# EAGLE design iDB2_Bridge_PCB_Rev1 (EAGLE 9.6.1)
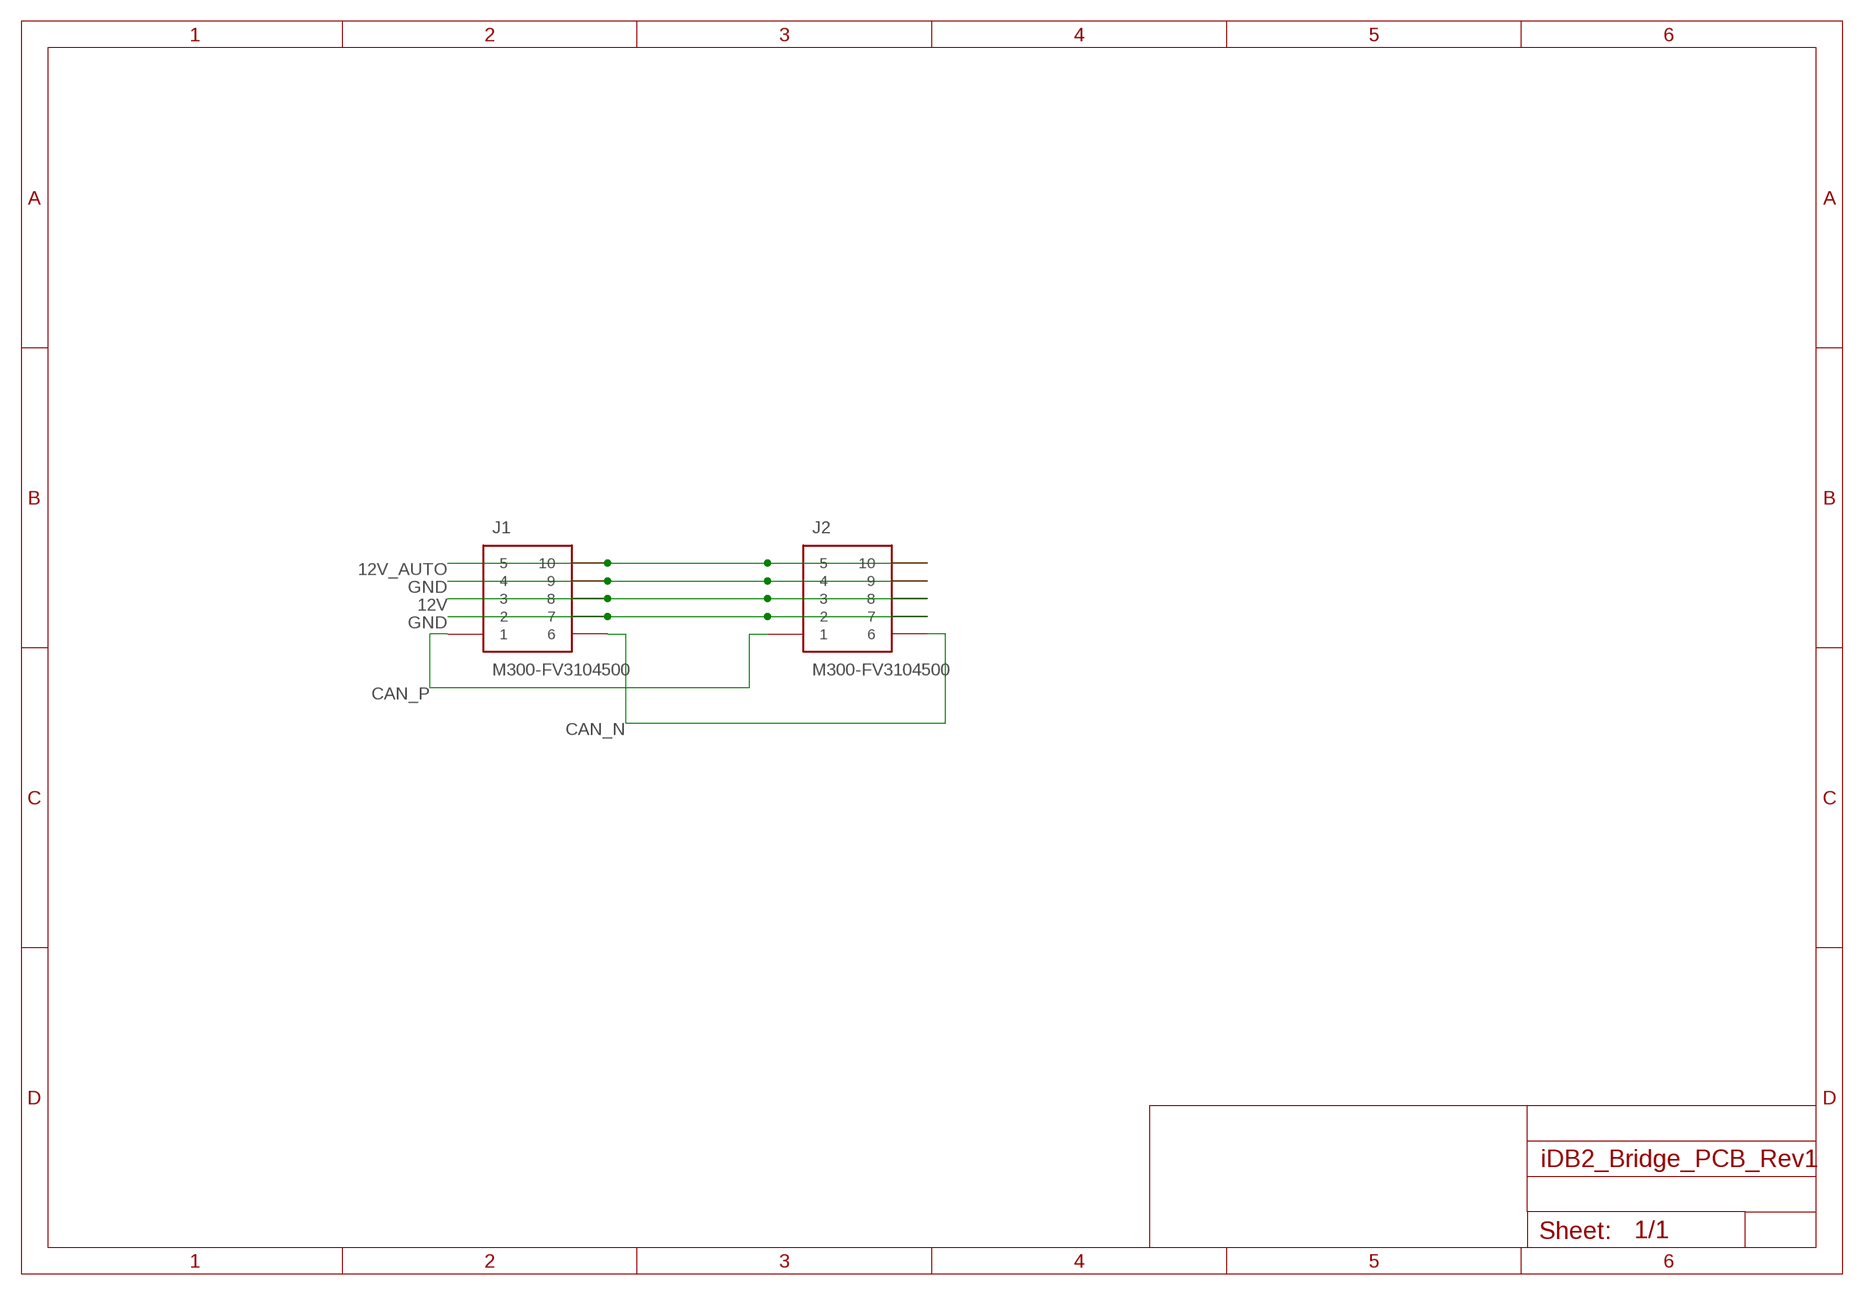
[diagram p0: schematic, sheet 1]

## Parts
J1  M300-FV3104500  [M300-FV3104500]
J2  M300-FV3104500  [M300-FV3104500]

## Nets
12V: J1.3 J1.8 J2.3 J2.8
12V_AUTO: J1.5 J1.10 J2.5 J2.10
CAN_N: J1.6 J2.6
CAN_P: J1.1 J2.1
GND: J1.2 J1.4 J1.7 J1.9 J2.2 J2.4 J2.7 J2.9

## Library data of the parts
J1 J2 = RescueRunner:M300-FV3104500: Headers & Wire Housings 10 WAY MALE PC TAIL DIL WJS Source: Datasheet <https://componentsearchengine.com/Datasheets/1/M300-MV31045M1.pdf>

## Net classes
0 default: width 0.2 mm

## Board
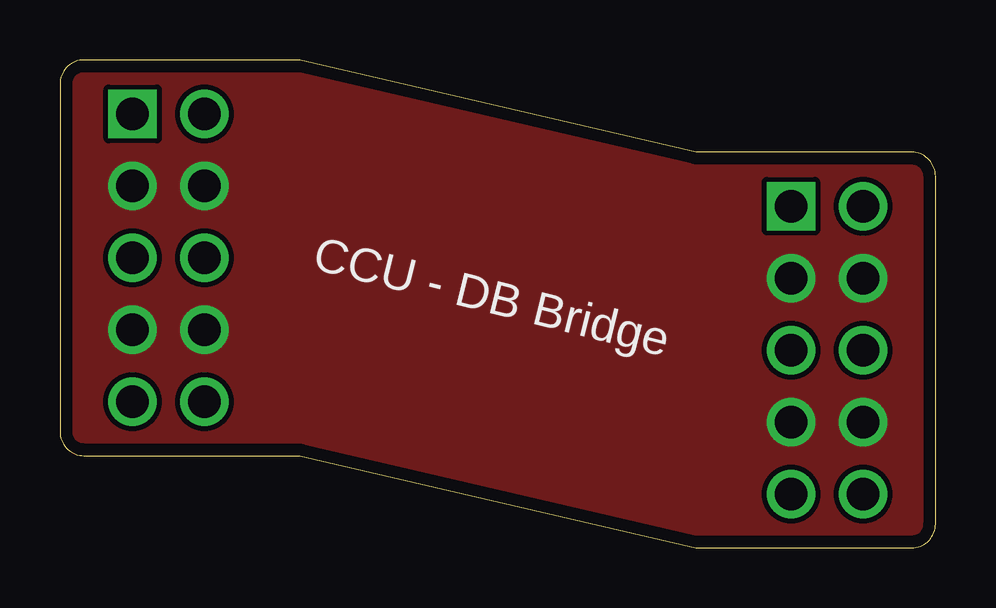
[diagram p1: board, top side]
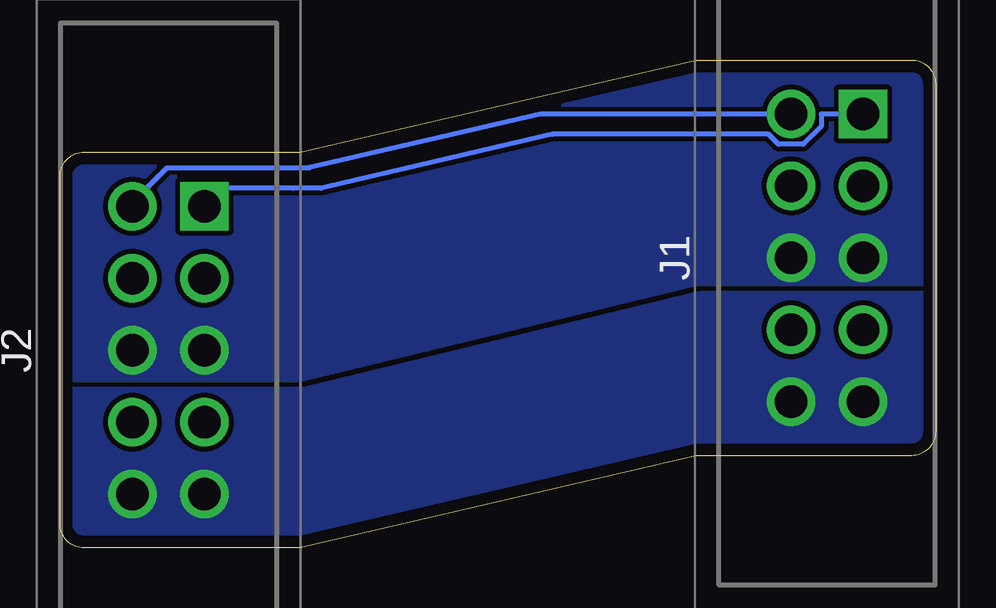
[diagram p2: board, bottom side, seen from below]

Size 36.5 x 20.35 mm. Coordinates in mm from the lower left corner, seen from the top.
Outline: 36.5,15.5 arc90 35.5,16.5 26.5,16.5 10,20.35 1,20.35 arc90 0,19.35 0,4.85 arc90 1,3.85 10,3.85 26.5,0 35.5,0 arc90 36.5,1 36.5,15.5
Copper layers (1*16): Top 0.035mm / dielectric 1.5mm / Bottom 0.035mm
Design rules "default *": minimum track width 6mil, minimum drill 0.35mm, track to track 8mil, track to pad 6mil, pad to pad 6mil, via to via 6mil, smd to smd 6mil, copper to edge 20mil, drill to drill 6mil, minimum pad ring 10mil, minimum via ring 8mil, stop-mask expansion 4mil, vias tented up to drill 0mil, thermal gap 10mil

### Footprints (pad centres in the part's own frame; a part is rotated, then mirrored left to right if it is on the bottom)
M300-FV3104500 = drill 1.35 pad 2.025 square: 1 12,0 | drill 1.35 pad 2.025: 2 9,0; 3 6,0; 4 3,0; 5 0,0; 6 12,3; 7 9,3; 8 6,3; 9 3,3; 10 0,3

### Placement (x,y rotation side)
J1  3.03,6.1 90 bottom
J2  30.47,2.25 90 bottom

### Tracks (layer width: path | path; a pad name or v marks a point on that pad's centre or on a via)
12V
  pour Bottom (no thermals): 0,11 10,11 26.5,7 36.5,7 36.5,16.5 10,20.5 0,20.5
12V_AUTO
  pour Bottom (rank 2, no thermals): 0,11 0,3.5 26.5,0 36.5,0 36.5,7 26.5,7 10,11
CAN_N
  Bottom 0.2: J1.6 16.47,18.1 26.1,15.85 26.42,15.85 32.04,15.85 33.47,14.42 J2.6
CAN_P
  Bottom 0.2: J1.1 4.76,18.1 4.76,17.57 5.5,16.83 6.55,16.83 6.96,17.25 15.97,17.25 25.6,15 26.78,15 29.73,15 J2.1
GND
  pour Top (no thermals): 0,20.5 32.5,20.5 36.5,16.5 36.5,0 4,0 0,4

### Text on the board
tPlace: CCU - DB Bridge